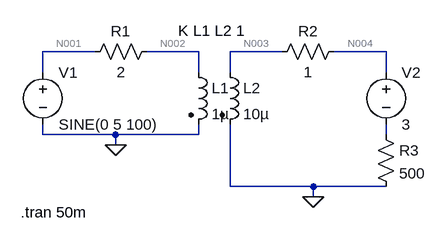
[diagram p0: schematic Draft1.asc]
Draft1.asc, the LTspice schematic file:
Version 4
SHEET 1 880 680
WIRE 112 144 32 144
WIRE 272 144 192 144
WIRE 400 144 320 144
WIRE 560 144 480 144
WIRE 32 176 32 144
WIRE 272 176 272 144
WIRE 320 176 320 144
WIRE 560 176 560 144
WIRE 32 272 32 256
WIRE 144 272 32 272
WIRE 272 272 272 256
WIRE 272 272 144 272
WIRE 560 272 560 256
WIRE 144 288 144 272
WIRE 320 352 320 256
WIRE 448 352 320 352
WIRE 560 352 448 352
WIRE 448 368 448 352
FLAG 144 288 0
FLAG 448 368 0
SYMBOL res 208 128 R90
WINDOW 0 0 56 VBottom 2
WINDOW 3 32 56 VTop 2
SYMATTR InstName R1
SYMATTR Value 2
SYMBOL res 496 128 R90
WINDOW 0 0 56 VBottom 2
WINDOW 3 32 56 VTop 2
SYMATTR InstName R2
SYMATTR Value 1
SYMBOL ind2 256 160 R0
SYMATTR InstName L1
SYMATTR Value 1µ
SYMATTR Type ind
SYMBOL ind2 304 160 R0
SYMATTR InstName L2
SYMATTR Value 10µ
SYMATTR Type ind
SYMBOL voltage 32 160 R0
WINDOW 123 0 0 Left 0
WINDOW 39 0 0 Left 0
SYMATTR InstName V1
SYMATTR Value SINE(0 5 100)
SYMBOL voltage 560 160 R0
WINDOW 123 0 0 Left 0
WINDOW 39 0 0 Left 0
SYMATTR InstName V2
SYMATTR Value 3
SYMBOL res 544 256 R0
SYMATTR InstName R3
SYMATTR Value 500
TEXT 240 112 Left 2 !K L1 L2 1
TEXT -2 392 Left 2 !.tran 50m

The netlist it stands for:
* Draft1.asc
R1 N002 N001 2
R2 N004 N003 1
L1 N002 0 1µ
L2 N003 0 10µ
V1 N001 0 SINE(0 5 100)
V2 N004 N005 3
R3 N005 0 500
K L1 L2 1
.tran 50m
.backanno
.end

* Results of the author's LTspice run, read from the files saved beside the schematic
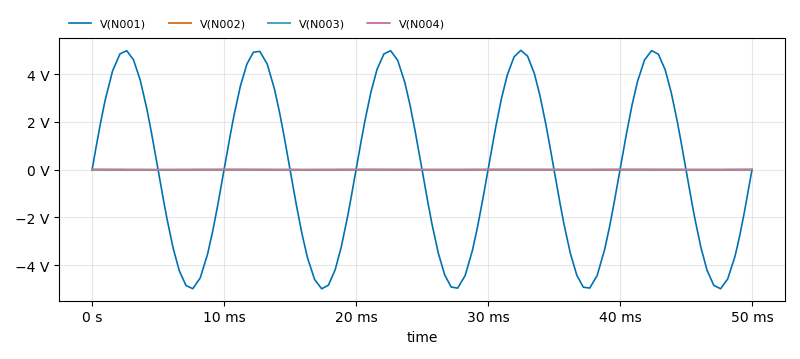
[diagram p1: Transient Analysis of Draft1.asc, plotted from the saved traces]
* Transient Analysis, 1 run:
*   V(N001): min -4.989 V, max 5 V, average -61.54 µV, rms 3.522 V, last 0 V
*   V(N002): min -1.571 mV, max 1.571 mV, average -31.28 nV, rms 1.115 mV, last 1.571 mV
*   V(N003): min -4.966 mV, max 4.967 mV, average -98.92 nV, rms 3.525 mV, last 4.967 mV
*   V(N004): min 1.03 mV, max 10.95 mV, average 5.988 mV, rms 6.945 mV, last 10.95 mV